# EAGLE design lab07 (EAGLE 9.6.0)
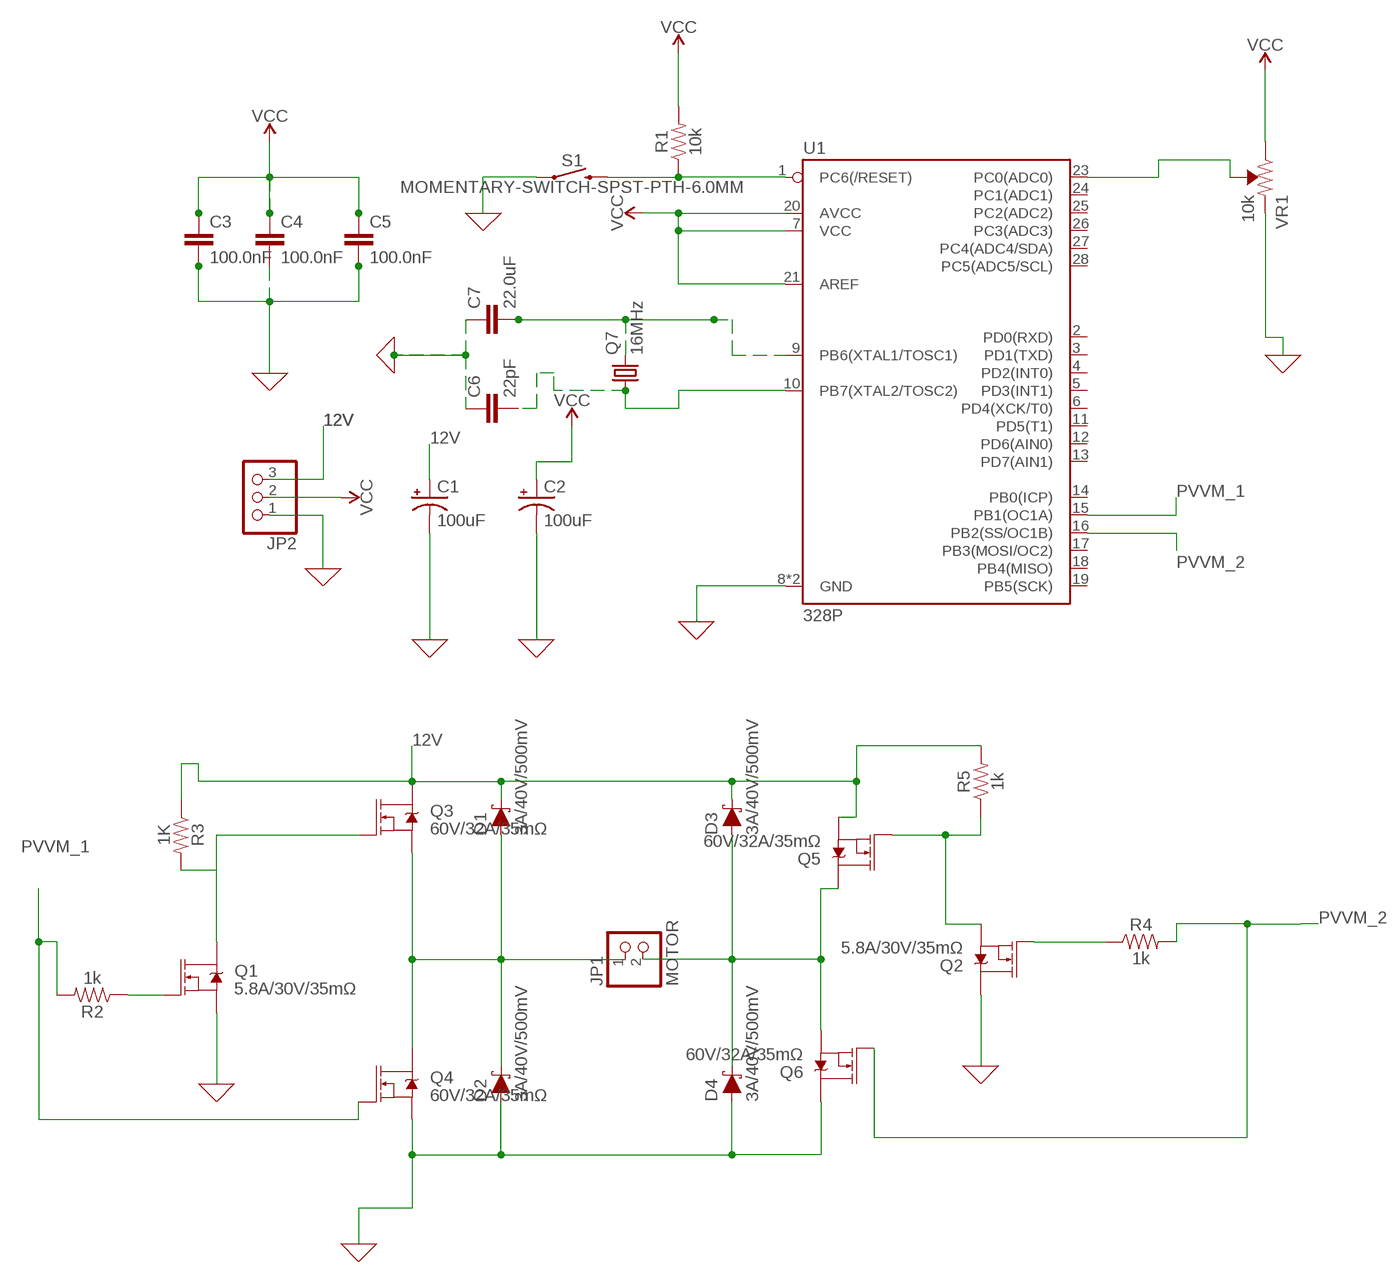
[diagram p0: schematic, sheet 1]

## Parts
C1  100uF  10UF-POLAR-RADIAL-2.5MM-25V-20%  [CPOL-RADIAL-2.5MM-5MM]
C2  100uF  10UF-POLAR-RADIAL-2.5MM-25V-20%  [CPOL-RADIAL-2.5MM-5MM]
C3  100.0nF  1.0UF-0805-25V-(+80/-20%)  [0805]
C4  100.0nF  1.0UF-0805-25V-(+80/-20%)  [0805]
C5  100.0nF  1.0UF-0805-25V-(+80/-20%)  [0805]
C6  22pF  1.0UF-0805-25V-(+80/-20%)  [0805]
C7  22.0uF  1.0UF-0805-25V-(+80/-20%)  [0805]
D1  3A/40V/500mV  DIODE-SCHOTTKY-B340A  [SMA-DIODE]
D2  3A/40V/500mV  DIODE-SCHOTTKY-B340A  [SMA-DIODE]
D3  3A/40V/500mV  DIODE-SCHOTTKY-B340A  [SMA-DIODE]
D4  3A/40V/500mV  DIODE-SCHOTTKY-B340A  [SMA-DIODE]
JP1  MOTOR  PINHD-1X2  [1X02]
JP2  PINHD-1X3  [1X03]
Q1  5.8A/30V/35mΩ  MOSFET-NCH-AO3404A  [SOT23-3]
Q2  5.8A/30V/35mΩ  MOSFET-NCH-AO3404A  [SOT23-3]
Q3  60V/32A/35mΩ  MOSFET-NCH-FQP30N06L  [TO220V]
Q4  60V/32A/35mΩ  MOSFET-NCH-FQP30N06L  [TO220V]
Q5  60V/32A/35mΩ  MOSFET-NCH-FQP30N06L  [TO220V]
Q6  60V/32A/35mΩ  MOSFET-NCH-FQP30N06L  [TO220V]
Q7  16MHz  CRYSTALHC49S  [HC49/S]
R1  10k  0.1OHM-1210-1/2W-1%  [1210]
R2  1k  0.1OHM-1210-1/2W-1%  [1210]
R3  1K  0.1OHM-1210-1/2W-1%  [1210]
R4  1k  0.1OHM-1210-1/2W-1%  [1210]
R5  1k  0.1OHM-1210-1/2W-1%  [1210]
S1  MOMENTARY-SWITCH-SPST-PTH-6.0MM  [TACTILE_SWITCH_PTH_6.0MM]
U1  328P  ATMEGA328P_PDIP  [DIP28]
VR1  10k  TRIMPOT-PTH-10MM-KNOB-1/2W-10%  [TRIMPOT-PTH-3386U]

## Nets
0: C1.2(-) C2.2(-) C3.2 C4.2 C5.2 C6.1 C7.1 D2.A D4.A JP2.1 Q1.2(S) Q2.3(D) Q4.3(S) Q6.2(D) S1.1 U1.8(GND) U1.22(GND) VR1.1(CCW) ; supply symbol labelled GND
12V: C1.1(+) D1.C D3.C JP2.3 Q3.2(D) Q5.3(S) R3.1 R5.2
N$2: U1.23(PC0(ADC0)) VR1.2(WIPER)
N$3: D1.A D2.C JP1.1 Q3.3(S) Q4.2(D)
N$4: C7.2 Q7.2 U1.9(PB6(XTAL1/TOSC1))
N$5: C6.2 Q7.1 U1.10(PB7(XTAL2/TOSC2))
N$7: R1.1 S1.3 U1.1(PC6(/RESET))
N$8: Q1.1(G) R2.1
N$9: Q1.3(D) Q3.1(G) R3.2
N$10: Q2.2(S) Q5.1(G) R5.1
N$11: D3.A D4.C JP1.2 Q5.2(D) Q6.3(S)
N$12: Q2.1(G) R4.1
PVVM_1: Q4.1(G) R2.2 U1.15(PB1(OC1A))
PVVM_2: Q6.1(G) R4.2 U1.16(PB2(SS/OC1B))
VCC: C2.1(+) C3.1 C4.1 C5.1 JP2.2 R1.2 U1.7(VCC) U1.20(AVCC) U1.21(AREF) VR1.3(CW)
Unconnected: U1.2(PD0(RXD)) U1.3(PD1(TXD)) U1.4(PD2(INT0)) U1.5(PD3(INT1)) U1.6(PD4(XCK/T0)) U1.11(PD5(T1)) U1.12(PD6(AIN0)) U1.13(PD7(AIN1)) U1.14(PB0(ICP)) U1.17(PB3(MOSI/OC2)) U1.18(PB4(MISO)) U1.19(PB5(SCK)) U1.24(PC1(ADC1)) U1.25(PC2(ADC2)) U1.26(PC3(ADC3)) U1.27(PC4(ADC4/SDA)) U1.28(PC5(ADC5/SCL))

## Library data of the parts
C1 C2 = SparkFun-Capacitors:10UF-POLAR: 10.0µF polarized capacitors A capacitor is a passive two-terminal electrical component used to store electrical energy temporarily in an electric field.; PROD_ID: CAP-08440; VALUE: 10uF
C3-C7 = SparkFun-Capacitors:1.0UF: 1µF ceramic capacitors A capacitor is a passive two-terminal electrical component used to store electrical energy temporarily in an electric field.; PROD_ID: CAP-11625; VALUE: 1.0uF
D1-D4 = SparkFun-DiscreteSemi:DIODE-SCHOTTKY: Schottky diode A Schottky diode is a semiconductor diode which has a low forward voltage drop and a very fast switching action.; PROD_ID: DIO-09886
JP1 = pinhead:PINHD-1X2: PIN HEADER
JP2 = adafruit:PINHD-1X3: PIN HEADER
Q1 Q2 = SparkFun-DiscreteSemi:MOSFET-NCH: N-channel MOSFETs Voltage controlled devices that allow control of high current outputs. SparkFun Products: SparkFun OpenScale <https://www.sparkfun.com/products/13261> SparkFun Digital Sandbox <https://www.sparkfun.com/products/12651> SparkFun Monster Moto Shield <https://www.sparkfun.com/products/10182> SparkFun MOSFET Power Controller <https://www.sparkfun.com/products/11214>; PROD_ID: TRANS-12988
Q3 Q4 Q6 = SparkFun-DiscreteSemi:MOSFET-NCH: N-channel MOSFETs Voltage controlled devices that allow control of high current outputs. SparkFun Products: SparkFun OpenScale <https://www.sparkfun.com/products/13261> SparkFun Digital Sandbox <https://www.sparkfun.com/products/12651> SparkFun Monster Moto Shield <https://www.sparkfun.com/products/10182> SparkFun MOSFET Power Controller <https://www.sparkfun.com/products/11214>; PROD_ID: TRANS-10060
Q5 = SparkFun-DiscreteSemi:MOSFET-NCH: N-channel MOSFETs Voltage controlled devices that allow control of high current outputs. SparkFun Products: SparkFun OpenScale <https://www.sparkfun.com/products/13261> SparkFun Digital Sandbox <https://www.sparkfun.com/products/12651> SparkFun Monster Moto Shield <https://www.sparkfun.com/products/10182> SparkFun MOSFET Power Controller <https://www.sparkfun.com/products/11214>; PROD_ID: TRANS-10060; SPICEPREFIX: Q
Q7 = adafruit:CRYSTAL: CRYSTAL; OC_FARNELL: 1667008; OC_NEWARK: unknown
R1-R5 = SparkFun-Resistors:0.1OHM: 0.1Ω resistor A resistor is a passive two-terminal electrical component that implements electrical resistance as a circuit element. Resistors act to reduce current flow, and, at the same time, act to lower voltage levels within circuits. - Wikipedia; PROD_ID: RES-12374; VALUE: 0.1
S1 = SparkFun-Switches:MOMENTARY-SWITCH-SPST: Momentary Switch (Pushbutton) - SPST Normally-open (NO) SPST momentary switches (buttons, pushbuttons). Variants PTH-12MM - 12mm square, through-hole Momentary Pushbutton Switch - 12mm Square <https://www.sparkfun.com/products/9190> (COM-09190) PTH-6.0MM, PTH-6.0MM-KIT - 6.0mm square, through-hole Mini Pushbutton Switch <https://www.sparkfun.com/products/97> (COM-00097) KIT package intended for soldering kit's - only one side of pads' copper is exposed. PTH-RIGHT-ANGLE-KIT - Right-angle, through-hole Right Angle Tactile Button <https://www.sparkfun.com/products/10791> - Used on SparkFun BigTime Watch Kit <https://www.sparkfun.com/products/11734> SMD-12MM - 12mm square, surface-mount Tactile Button - SMD (12mm) <https://www.sparkfun.com/products/12993> (COM-12993) Used on SparkFun PicoBoard <https://www.sparkfun.com/products/11888> SMD-4.5MM - 4.5mm Square Trackball Switch Used on SparkFun Blackberry Trackballer Breakout <https://www.sparkfun.com/products/13169> SMD-4.6MMX2.8MM - 4.60mm x 2.80mm, surface mount Used on SparkFun SAMD21 Mini Breakout <https://www.sparkfun.com/products/13664> SMD-5.2MM, SMD-5.2-REDUNDANT - 5.2mm square, surface-mount Mini Pushbutton Switch - SMD <https://www.sparkfun.com/products/8720> (COM-08720) Used on Arduino Pro Mini <https://www.sparkfun.com/products/11114> REDUNDANT package connects both switch circuits together SMD-6.0X3.5MM - 6.0 x 3.5mm, surface mount Momentary Reset Switch SMD <https://www.sparkfun.com/products/8229> (COM-08229) SMD-6.2MM-TALL - 6.2mm square, surface mount Tactile Button - SMD (6mm) <https://www.sparkfun.com/products/12992> Used on SparkFun Digital Sandbox <https://www.sparkfun.com/products/12651> SMD-RIGHT-ANGLE - Right-angle, surface mount Used on SparkFun Block for Intel® Edison - Arduino <https://www.sparkfun.com/products/13036>; PROD_ID: SWCH-08441; SF_SKU: COM-00097
U1 = SparkFun-IC-Microcontroller:ATMEGA328P_PDIP: Atmel 328P Through hole ATMEGA328P uC used in the Arduino 32kb flash, 1k EEPROM, 2k SRAM Datasheet <http://www.sparkfun.com/datasheets/Components/SMD/ATMega328.pdf> SparkFun Products Storefront component: AVR 28 Pin 20MHz 32K 6A/D - ATMega328P <https://www.sparkfun.com/products/9061> (COM-09061) SparkFun Simon Says - Through-Hole Soldering Kit <https://www.sparkfun.com/products/10547> (KIT-10547) SparkFun Learn to Solder - Simon Says <https://www.sparkfun.com/products/13708> (KIT-13708) SparkFun BigTime Watch Kit <https://www.sparkfun.com/products/11734> (KIT-11734) SparkFun ClockIt <https://www.sparkfun.com/products/10930> (KIT-10930) SparkFun Serial Enabled LCD Kit <https://www.sparkfun.com/products/10097> (LCD-10097) SparkFun Simon Tilts - Through Hole Soldering Kit <https://www.sparkfun.com/products/12634> (KIT-12634) SparkFun Frequency Counter Kit <https://www.sparkfun.com/products/10140> (KIT-10140) FabFM Radio Kit <https://www.sparkfun.com/products/11043> (KIT-11043) SparkFun Binary Blaster Kit <https://www.sparkfun.com/products/12037> (KIT-12037) SparkFun Metro-Gnome <https://www.sparkfun.com/products/9236> (KIT-09236) ATmega328 with Arduino Optiboot (Uno) <https://www.sparkfun.com/products/10524> (DEV-10524); PROD_ID: IC-09136
VR1 = SparkFun-Resistors:TRIMPOT: Trimming Potentiometer (Trimpot) Three-terminal potentiometers, with an adjustable wiper and two adjustable resistors. A pot can be used to create a configurable voltage divider, or as a variable resistor. "Trimpots" are a subset of potentiometers, usually intended for "set-and-forget" applications. They're often more delicate than standard potentiometers - rated for fewer turns. Variants PTH-KNOB - PTH Trimpot w/ finger-adjustable knob Trimpot 10K with Knob <https://www.sparkfun.com/products/9806> (COM-09806) Datasheet <http://www.sparkfun.com/datasheets/Components/General/TSR-3386.pdf> SMD-3MM-CLOSED-FRAME - SMD 3mm Square Closed-Frame Trimpot Used on e.g. EasyDriver - Stepper Motor Driver <https://www.sparkfun.com/products/12779> Datasheet <http://www.bitechnologies.com/pdfs/22.pdf> (22AR10KTR) SMD-5MM - SMD 5mm Square Closed-Frame Trimpot Used on e.g. IOIO-OTG - V2.2 <https://www.sparkfun.com/products/13613> Datasheet <http://www.vishay.com/docs/51008/ts53.pdf> (TS53YL502MR10) SMD-3MM-1/10W-25% - 3mm Square Open-Frame Trimpot Used on e.g. SparkFun Shapeoko <https://www.sparkfun.com/products/13899> Datasheet <http://www.bourns.com/docs/Product-Datasheets/TC33.pdf> (TC33X-2-103E); PROD_ID: RES-09730; SF_SKU: COM-09806

## Board
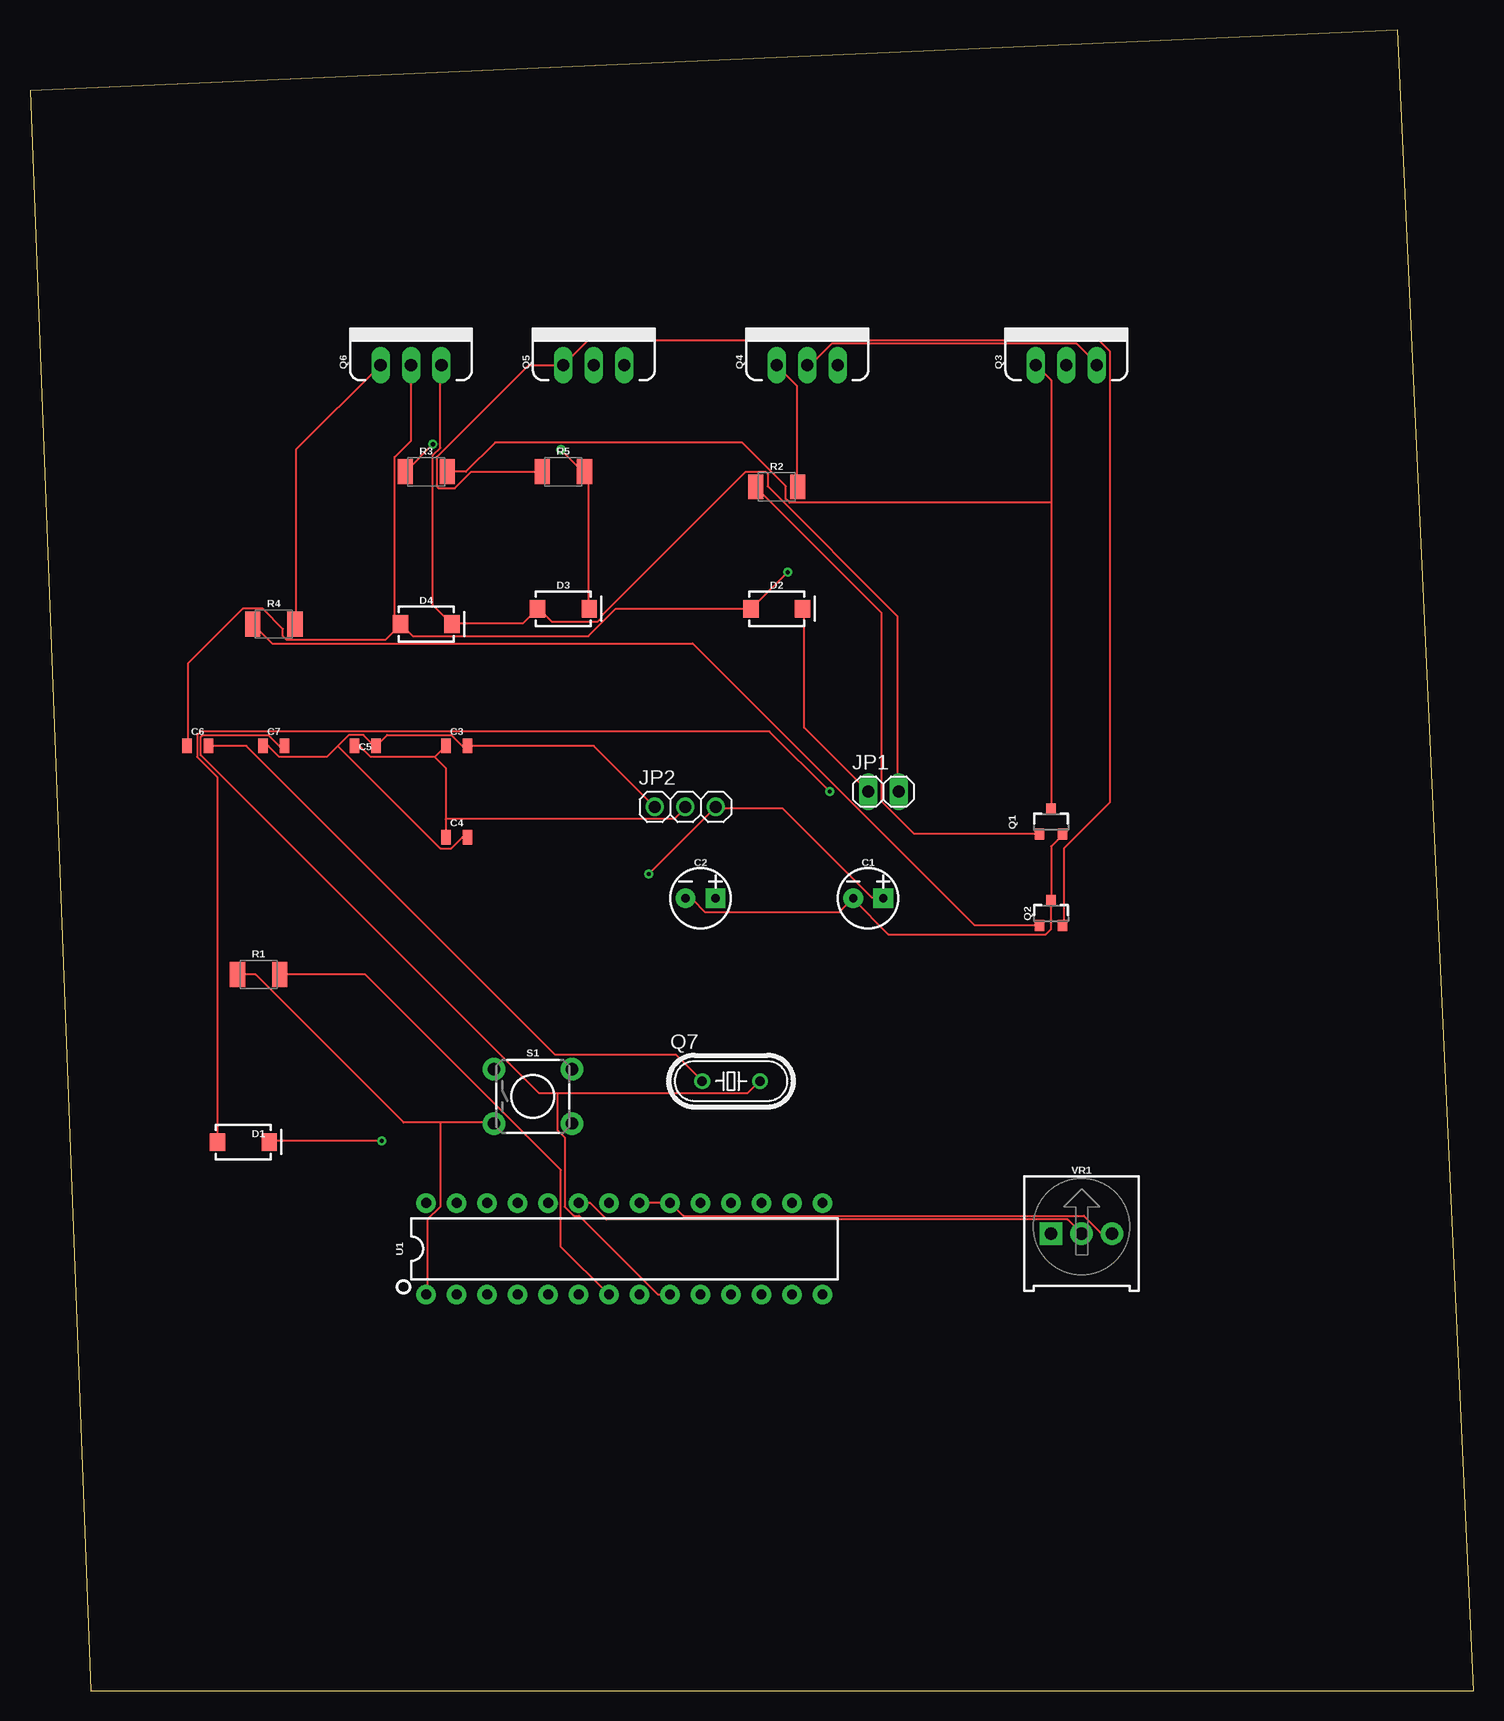
[diagram p1: board, top side]
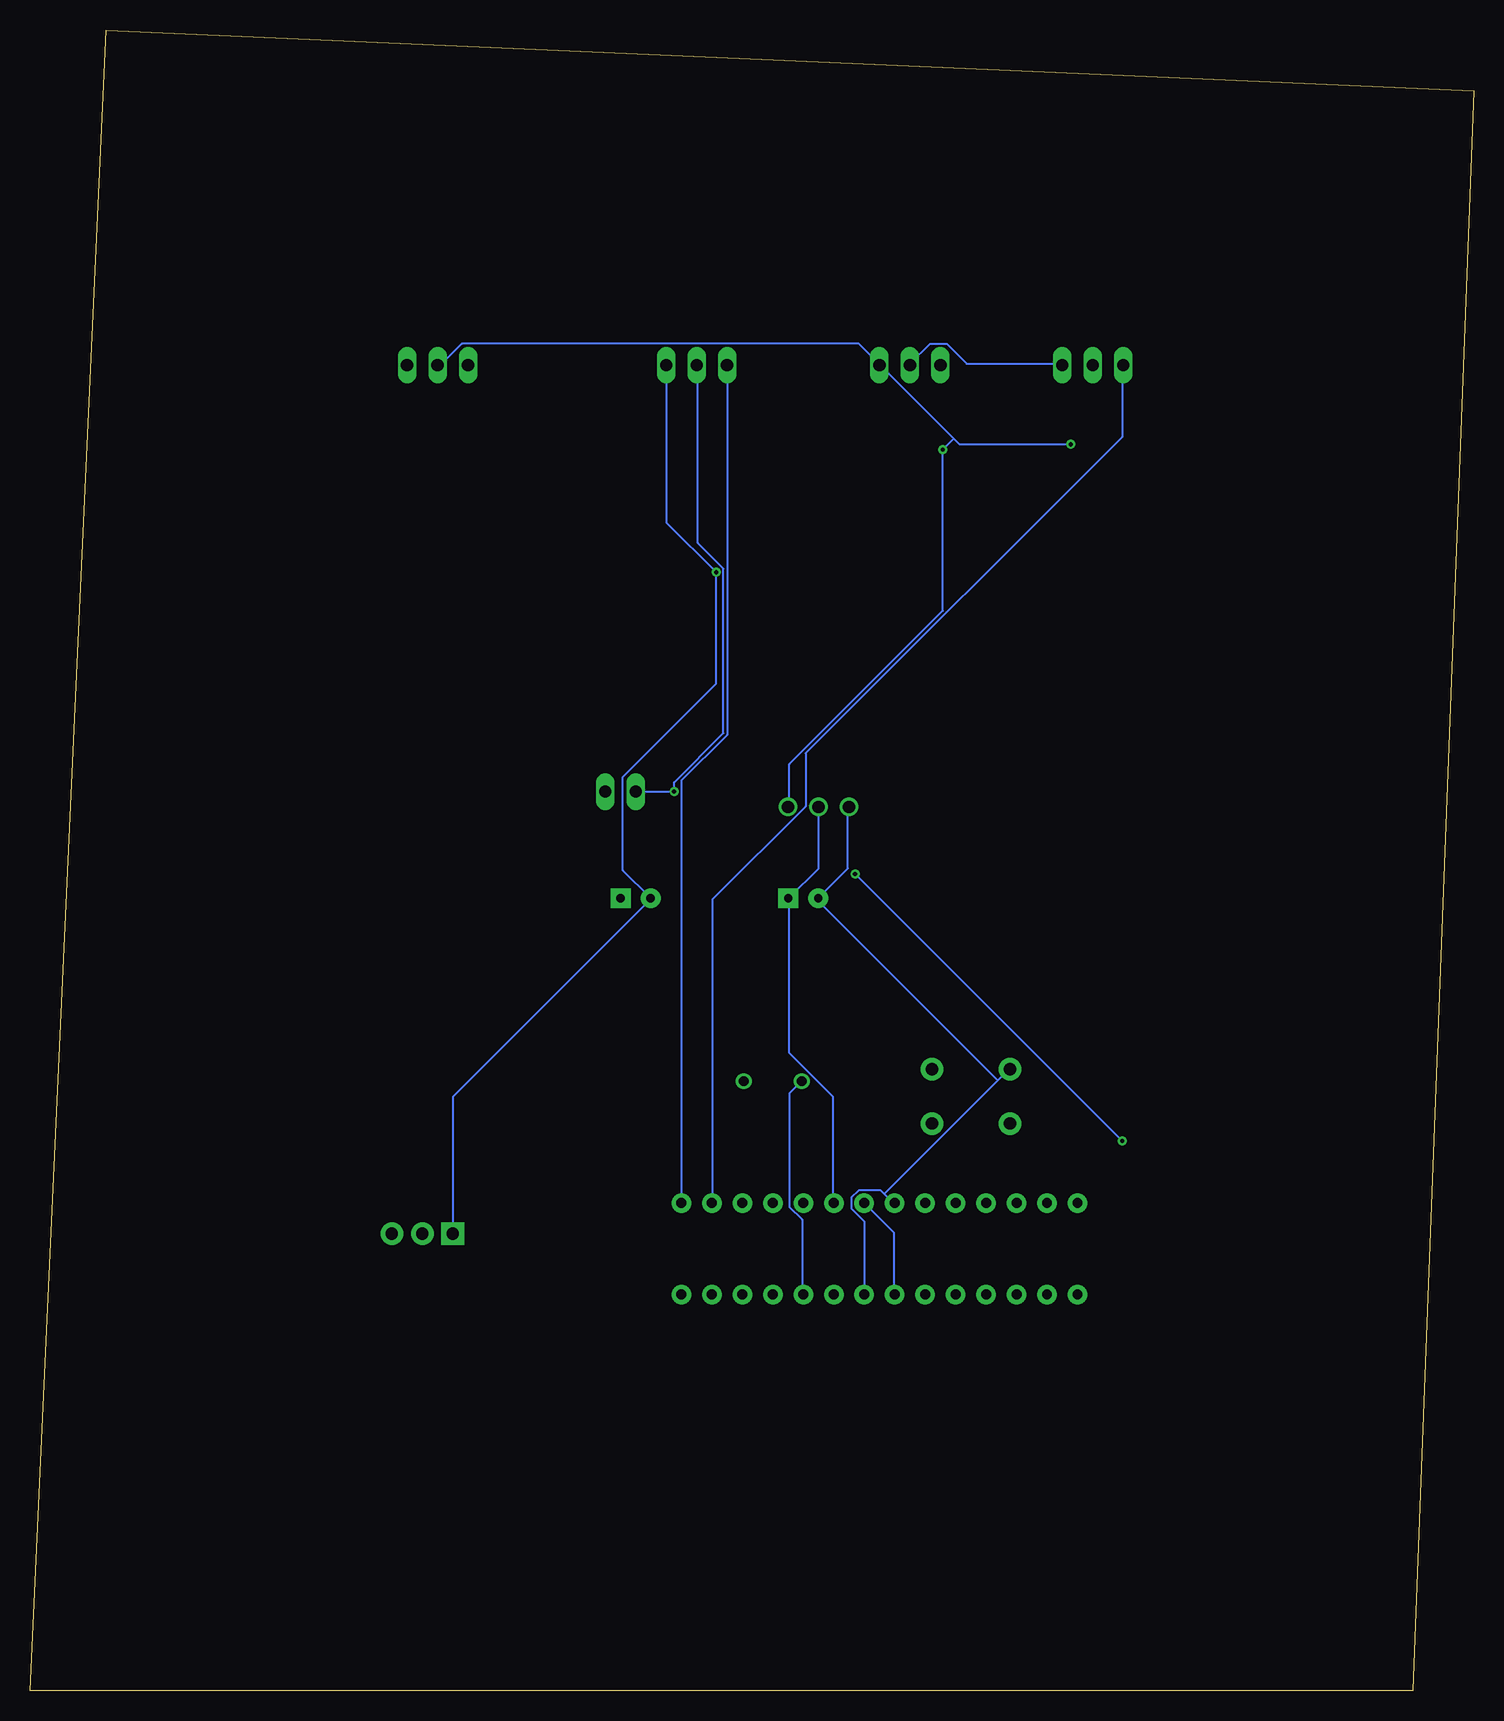
[diagram p2: board, bottom side, seen from below]

Size 120.32 x 138.42 mm. Coordinates in mm from the lower left corner, seen from the top.
Outline: 5.08,0 120.32,0 113.97,138.42 0,133.34 5.08,0
Copper layers (1*16): Top 0.035mm / dielectric 1.5mm / Bottom 0.035mm
Design rules "default": minimum track width 6mil, minimum drill 0.35mm, track to track 6mil, track to pad 6mil, pad to pad 6mil, via to via 6mil, smd to smd 6mil, copper to edge 40mil, drill to drill 6mil, minimum pad ring 10mil, minimum via ring 8mil, stop-mask expansion 4mil, vias tented up to drill 0mil, thermal gap 10mil

### Footprints (pad centres in the part's own frame; a part is rotated, then mirrored left to right if it is on the bottom)
CPOL-RADIAL-2.5MM-5MM = drill 0.7 pad 1.651 square: 1 1.25,0 | drill 0.7 pad 1.651: 2 -1.25,0
0805 = smd 0.8 x 1.2: 1 -0.9,0; 2 0.9,0
SMA-DIODE = smd 1.27 x 1.47: A -2.15,0; C 2.15,0
1X02 = drill 1.016 long: 1 -1.27,0; 2 1.27,0
1X03 = drill 1.016: 1 -2.54,0; 2 0,0; 3 2.54,0
SOT23-3 = smd 0.8 x 0.9: 1 -0.95,-1; 2 0.95,-1; 3 0,1.1
TO220V = drill 1.016 long: 1 -2.54,0; 2 0,0; 3 2.54,0
HC49/S = drill 0.813: 1 -2.413,0; 2 2.413,0
1210 = smd 1.27 x 2.06: 1 -1.755,0; 2 1.755,0
TACTILE_SWITCH_PTH_6.0MM = drill 1.016 pad 1.88: 1 -3.251,2.261; 2 3.251,2.261; 3 -3.251,-2.261; 4 3.251,-2.261
DIP28 = drill 0.813 pad 1.626: 1 -16.51,-3.81; 2 -13.97,-3.81; 3 -11.43,-3.81; 4 -8.89,-3.81; 5 -6.35,-3.81; 6 -3.81,-3.81; 7 -1.27,-3.81; 8 1.27,-3.81; 9 3.81,-3.81; 10 6.35,-3.81; 11 8.89,-3.81; 12 11.43,-3.81; 13 13.97,-3.81; 14 16.51,-3.81; 15 16.51,3.81; 16 13.97,3.81; 17 11.43,3.81; 18 8.89,3.81; 19 6.35,3.81; 20 3.81,3.81; 21 1.27,3.81; 22 -1.27,3.81; 23 -3.81,3.81; 24 -6.35,3.81; 25 -8.89,3.81; 26 -11.43,3.81; 27 -13.97,3.81; 28 -16.51,3.81
TRIMPOT-PTH-3386U = drill 1.016 pad 1.88 square: 1 -2.54,-0.015 | drill 1.016 pad 1.88: 2 0,-0.015; 3 2.54,-0.015

### Placement (x,y rotation side)
C1  69.85,66.04 0 top
C2  55.88,66.04 0 top
C3  35.56,78.74 0 top
C4  35.56,71.12 0 top
C5  27.94,78.74 0 top
C6  13.97,78.74 0 top
C7  20.32,78.74 0 top
D1  17.78,45.72 0 top
D2  62.23,90.17 0 top
D3  44.45,90.17 0 top
D4  33.02,88.9 0 top
JP1  71.12,74.93 0 top
JP2  54.61,73.66 0 top
Q1  85.09,72.39 0 top
Q2  85.09,64.77 0 top
Q3  86.36,110.49 0 top
Q4  64.77,110.49 0 top
Q5  46.99,110.49 0 top
Q6  31.75,110.49 0 top
Q7  58.42,50.8 0 top
R1  19.05,59.69 0 top
R2  62.23,100.33 0 top
R3  33.02,101.6 0 top
R4  20.32,88.9 0 top
R5  44.45,101.6 0 top
S1  41.91,49.53 0 top
U1  49.53,36.83 0 top
VR1  87.63,38.1 0 top

### Tracks (layer width: path | path; a pad name or v marks a point on that pad's centre or on a via)
0  (via drill 0.35)
  Top 0.152: C6.1 13.16,78.74 13.16,85.6 17.73,90.17 19.41,90.17 21.08,88.49 21.08,87.88 21.39,87.58 29.62,87.58 30.84,88.8 D4.A | D4.A 30.99,88.8 31.9,87.88 46.53,87.88 48.82,90.17 D2.A 60.1,90.17 v63.14,93.22 | Q6.2 31.75,104.19 30.38,102.82 30.38,89.41 30.84,88.95 D4.A | C7.1 19.86,78.74 20.78,77.83 24.74,77.83 25.65,78.74 | 25.65,78.74 26.57,79.65 27.79,79.65 28.7,78.74 C5.2 28.85,78.74 29.77,79.65 35.1,79.65 36.02,78.74 C3.2 46.99,78.74 JP2.1 | C4.2 36.02,71.12 35.1,70.21 34.19,70.21 25.65,78.74 | Q1.2 86,71.27 85.09,70.36 Q2.3 85.09,63.5 84.63,63.04 71.53,63.04 68.63,65.94 C1.2 68.48,65.94 67.41,64.87 56.29,64.87 55.22,65.94 54.76,65.94 C2.2
  Bottom 0.152: Q4.3 67.26,110.44 67.26,97.33 v63.14,93.22 63.14,83.92 70.92,76.15 70.92,68.38 68.63,66.09 C1.2 68.63,65.94 85.09,49.48 VR1.1 | U1.8 50.8,39.12 51.87,40.18 51.87,41.1 51.26,41.71 49.43,41.71 49.12,41.4 | 49.12,41.4 48.36,40.64 U1.22 | 49.12,41.4 39.67,50.85 | 39.67,50.85 38.76,51.77 S1.1 | JP2.1 52.17,73.56 52.17,68.53 54.61,66.09 C2.2 54.76,65.94 39.67,50.85
12V  (via drill 0.35)
  Top 0.152: D3.C 46.53,90.17 46.53,101.29 46.23,101.6 R5.2 46.08,101.6 v44.25,103.43 | v33.58,103.89 31.29,101.6 R3.1 | v29.31,45.82 20.02,45.82 D1.C | v51.56,68.07 JP2.3 57.2,73.56 62.69,73.56 70.16,66.09 71.07,66.09 C1.1
  Bottom 0.152: v33.58,103.89 42.88,103.89 43.33,104.34 | 43.33,104.34 49.43,110.44 Q5.3 49.58,110.59 51.26,112.27 84.33,112.27 86,110.59 86.31,110.59 Q3.2 | 43.33,104.34 v44.25,103.43 44.25,90.02 57.05,77.22 57.05,73.71 JP2.3 | v51.56,68.07 v29.31,45.82
N$2
  Top 0.152: U1.23 46.68,40.64 48.06,39.27 86.46,39.27 87.53,38.2 VR1.2
N$3  (via drill 0.35)
  Top 0.152: Q4.2 64.82,110.59 65.13,110.59 66.8,112.27 87.22,112.27 88.9,110.59 Q3.3 | v66.65,74.93 61.62,79.96 14.22,79.96 13.92,79.65 13.92,77.83 15.6,76.15 15.6,45.82 D1.A | JP1.1 64.52,80.26 64.52,90.17 D2.C
  Bottom 0.152: JP1.1 v66.65,74.93 66.65,75.69 62.54,79.81 62.54,93.52 64.67,95.66 64.67,110.44 Q4.2
N$4
  Top 0.152: C7.2 20.78,78.74 19.86,79.65 14.38,79.65 14.22,79.5 14.22,77.98 42.42,49.78 43.94,49.78 | 43.94,49.78 59.79,49.78 60.71,50.7 Q7.2 | U1.9 52.32,33.02 45.77,39.57 45.31,39.57 44.55,40.34 44.55,46.13 43.94,46.74 43.94,49.78
N$5
  Top 0.152: C6.2 18.03,78.74 43.79,52.98 53.85,52.98 55.98,50.85 Q7.1
  Bottom 0.152: U1.10 55.98,33.02 55.98,39.27 57.05,40.34 57.05,49.78 56.13,50.7 Q7.1
N$7
  Top 0.152: R1.1 18.8,59.69 31.14,47.35 34.19,47.35 | 34.19,47.35 38.61,47.35 S1.3 | 34.19,47.35 34.19,40.34 33.12,39.27 33.12,33.02 U1.1
N$8
  Top 0.152: Q1.1 84.02,71.43 73.66,71.43 70.92,74.17 70.92,89.87 60.55,100.23 R2.1
N$9
  Top 0.152: 85.09,99.01 85.09,109.22 Q3.1 | 85.09,99.01 Q1.3 | R3.2 36.32,101.6 38.76,104.04 59.33,104.04 62.99,100.38 62.99,99.31 63.3,99.01 85.09,99.01
N$10
  Top 0.152: Q2.2 86.16,63.8 86.16,70.21 89.97,74.02 89.97,111.66 89.05,112.57 46.53,112.57 Q5.1 44.4,110.44 41.5,110.44 33.88,102.82 33.88,100.38 34.04,100.23 35.41,100.23 36.78,101.6 R5.1
N$11
  Top 0.152: JP1.2 72.29,74.93 72.29,89.56 61.47,100.38 61.47,101.45 61.32,101.6 59.64,101.6 47.6,89.56 47.6,89.41 47.3,89.1 43.48,89.1 42.42,90.17 D3.A 42.27,90.17 41.05,88.95 35.25,88.95 D4.C 35.1,88.95 33.58,90.47 33.58,102.97 34.19,103.58 34.19,110.44 Q6.3
  Bottom 0.152: Q6.3 34.34,110.59 42.27,110.59 43.94,112.27 45.31,112.27 46.99,110.59 Q5.2
N$12
  Top 0.152: Q2.1 84.02,63.8 78.69,63.8 55.22,87.27 20.17,87.27 18.64,88.8 R4.1
PVVM_1
  Top 0.152: R2.2 63.91,100.38 63.91,108.76 62.23,110.44 Q4.1
  Bottom 0.152: U1.15 66.04,75.84 62.23,79.65 Q4.1
PVVM_2
  Top 0.152: Q6.1 22.15,103.43 22.15,88.95 R4.2
  Bottom 0.152: U1.16 63.45,40.64 63.45,65.94 55.68,73.71 55.68,78.13 29.31,104.5 29.31,110.44 Q6.1
VCC
  Top 0.152: R1.2 27.94,59.69 44.25,43.38 44.25,36.98 48.21,33.02 U1.7 | C5.1 27.48,78.74 28.4,77.83 33.73,77.83 | 33.73,77.83 34.65,78.74 C3.1 | 34.65,72.64 34.65,76.91 33.73,77.83 | 34.65,72.64 34.65,71.12 C4.1 | 34.65,72.64 53.7,72.64 54.61,73.56 JP2.2 | U1.21 U1.20 53.39,40.64 54.46,39.57 87.83,39.57 89.21,38.2 90.12,38.2 VR1.3
  Bottom 0.152: JP2.2 54.61,68.53 57.05,66.09 C2.1 57.05,65.94 57.05,53.14 53.39,49.48 53.39,40.64 U1.20 | U1.21 48.36,38.2 48.36,33.02 U1.7